# Altium schematic sheet PICKIT2-Original-WithOut-Memory-1.SchDoc
size A
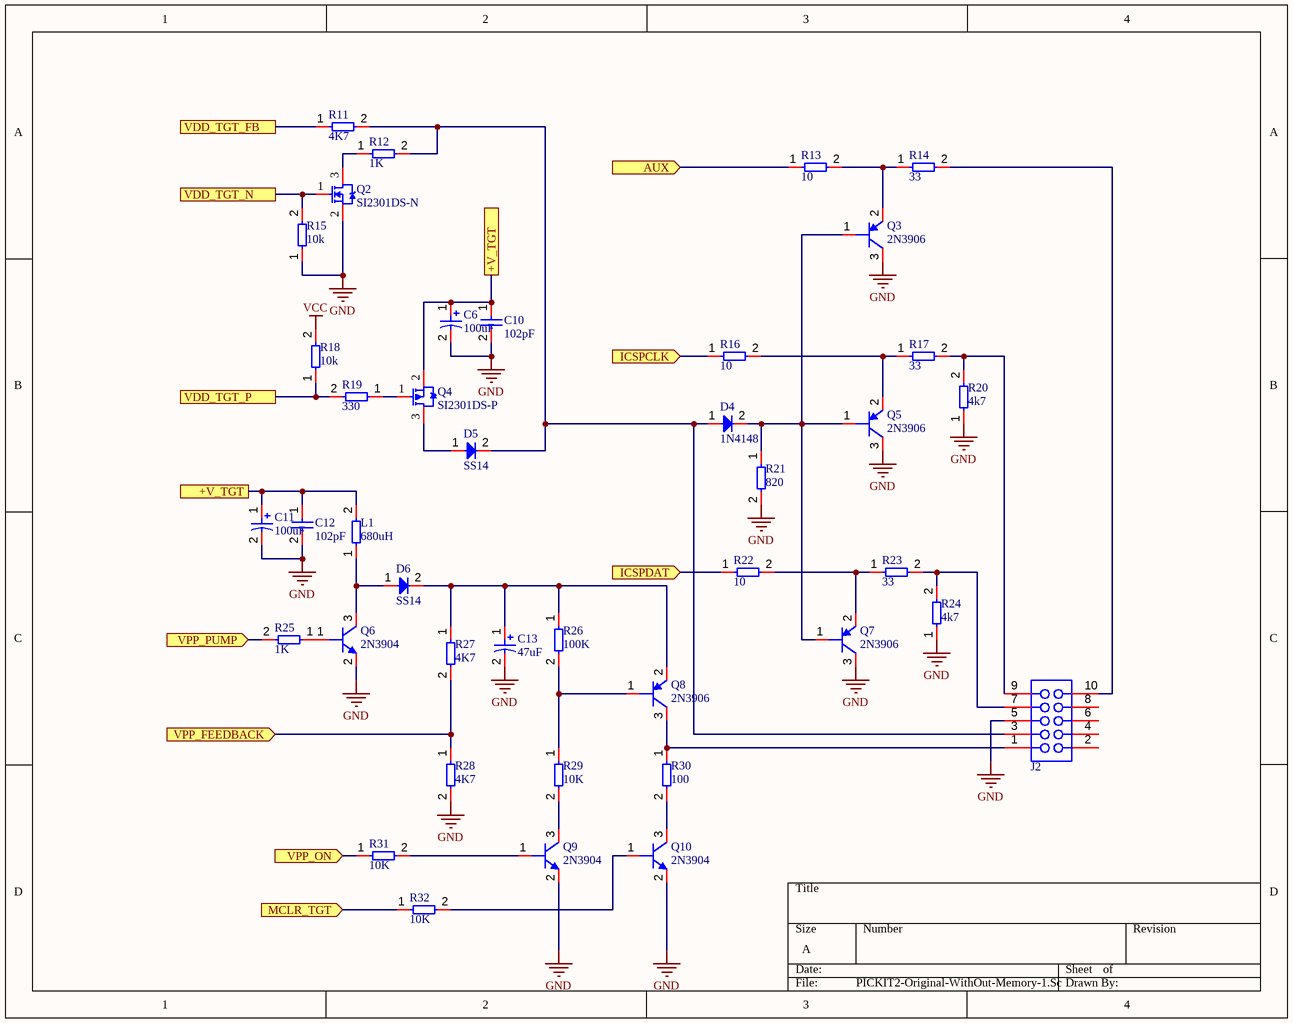
[diagram p0: PICKIT2-Original-WithOut-Memory-1.SchDoc]

## Parts
C6  100uF  [CAP_RAD_4mm]
C10  102pF  [C0805]
C11  100uF  [CAP_RAD_4mm]
C12  102pF  [C0805]
C13  47uF  [CAP_RAD_4mm]
D4  1N4148  [SOD-80]
D5  SS14  [DO-214AC(SMA)]
D6  SS14  [DO-214AC(SMA)]
J2  Header 5x2 TH Pitch 2.54mm  [Header 5x2 TH Pitch 2.54mm]  (value not drawn)
L1  680uH  [RES-0.5W-HH-MF]
Q2  SI2301DS-N  [SOT23-3]
Q3  2N3906  [SOT23-3]
Q4  SI2301DS-P
Q5  2N3906  [SOT23-3]
Q6  2N3904  [SOT23-3]
Q7  2N3906  [SOT23-3]
Q8  2N3906  [SOT23-3]
Q9  2N3904  [SOT23-3]
Q10  2N3904  [SOT23-3]
R11  4K7  [R0805]
R12  1K  [R0805]
R13  10  [R0805]
R14  33  [R0805]
R15  10k  [R0805]
R16  10  [R0805]
R17  33  [R0805]
R18  10k  [R0805]
R19  330  [R0805]
R20  4k7  [R0805]
R21  820  [R0805]
R22  10  [R0805]
R23  33  [R0805]
R24  4k7  [R0805]
R25  1K  [R0805]
R26  100K  [R0805]
R27  4K7  [R0805]
R28  4K7  [R0805]
R29  10K  [R0805]
R30  100  [R0805]
R31  10K  [R0805]
R32  10K  [R0805]

## Ports
+V_TGT, AUX (in), ICSPCLK (in), ICSPDAT (in), MCLR_TGT (in), VDD_TGT_FB, VDD_TGT_N, VDD_TGT_P, VPP_FEEDBACK (in), VPP_ON (in), VPP_PUMP (in)

## Nets
GND: C6.2 C10.2 C11.2 C12.2 C13.2 J2.5 Q2.2(S) Q3.3(C) Q5.3(C) Q6.2(E) Q7.3(C) Q9.2(E) Q10.2(E) R15.1 R20.1 R21.2 R24.1 R28.2
VCC: R18.2
+V_TGT: C6.1 C10.1 C11.1 C12.1 L1.2 Q4.2(S) ; port +V_TGT
AUX: R13.1 ; port AUX
ICSPCLK: R16.1 ; port ICSPCLK
ICSPDAT: R22.1 ; port ICSPDAT
MCLR_TGT: R32.1 ; port MCLR_TGT
VDD_TGT_FB: R11.1 ; port VDD_TGT_FB
VDD_TGT_N: Q2.1(G) R15.2 ; port VDD_TGT_N
VDD_TGT_P: R18.1 R19.2 ; port VDD_TGT_P
VPP_FEEDBACK: R27.2 R28.1 ; port VPP_FEEDBACK
VPP_ON: R31.1 ; port VPP_ON
VPP_PUMP: R25.2 ; port VPP_PUMP
NetC13_1: C13.1 D6.2 Q8.2(E) R26.1 R27.1
NetD4_1: D4.1 D5.2 J2.3 R11.2 R12.2
NetD4_2: D4.2 Q3.1(B) Q5.1(B) Q7.1(B) R21.1
NetD5_1: D5.1 Q4.3(D)
NetD6_1: D6.1 L1.1 Q6.3(C)
NetJ2_1: J2.1 Q8.3(C) R30.1
NetJ2_7: J2.7 R23.2 R24.2
NetJ2_9: J2.9 R17.2 R20.2
NetJ2_10: J2.10 R14.2
NetQ2_3: Q2.3(D) R12.1
NetQ3_2: Q3.2(E) R13.2 R14.1
NetQ4_1: Q4.1(G) R19.1
NetQ5_2: Q5.2(E) R16.2 R17.1
NetQ6_1: Q6.1(B) R25.1
NetQ7_2: Q7.2(E) R22.2 R23.1
NetQ8_1: Q8.1(B) R26.2 R29.1
NetQ9_1: Q9.1(B) R31.2
NetQ9_3: Q9.3(C) R29.2
NetQ10_1: Q10.1(B) R32.2
NetQ10_3: Q10.3(C) R30.2

Not connected (* = marked no-connect by the designer): J2 2 4 6 8

## Library data of the parts
C6 C11 C13 = Capacitor(Radian)
C10 C12 = Capacitors(SMD)
D4 = 1N4148 (SOD-80)
D5 D6 = Diode 1N4007-DO214AC(SMA)
L1 = Resistors THD
R11-R32 = Resistor SMD